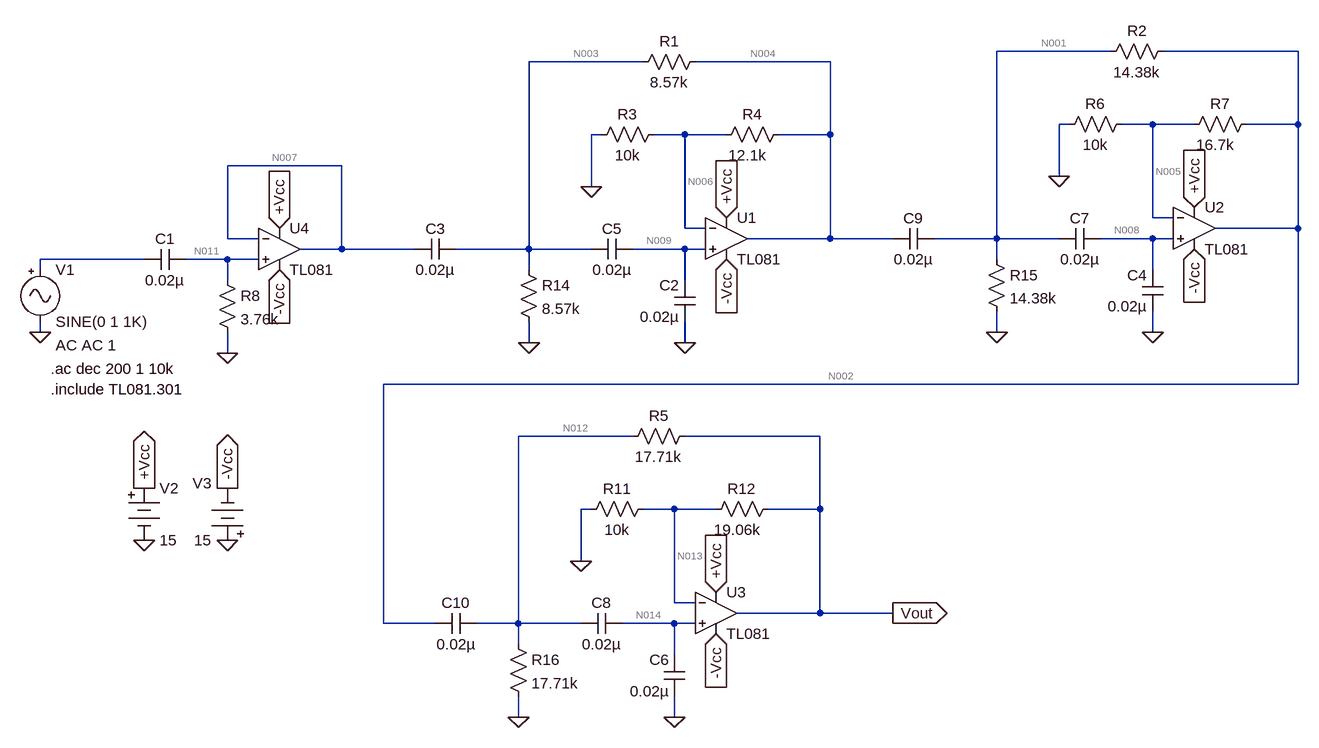
[diagram p0: schematic 7th order Chebyshev filter.asc]
7th order Chebyshev filter.asc, the LTspice schematic file:
Version 4
SHEET 1 2320 916
WIRE 1088 -144 912 -144
WIRE 1376 -144 1168 -144
WIRE 368 -128 192 -128
WIRE 656 -128 448 -128
WIRE 1024 -32 1008 -32
WIRE 1152 -32 1104 -32
WIRE 1216 -32 1152 -32
WIRE 1376 -32 1376 -144
WIRE 1376 -32 1296 -32
WIRE 304 -16 288 -16
WIRE 432 -16 384 -16
WIRE 496 -16 432 -16
WIRE 656 -16 656 -128
WIRE 656 -16 576 -16
WIRE -96 32 -272 32
WIRE 1008 48 1008 -32
WIRE 288 64 288 -16
WIRE 1152 112 1152 -32
WIRE 1184 112 1152 112
WIRE 432 128 432 -16
WIRE 464 128 432 128
WIRE 1376 128 1376 -32
WIRE 1376 128 1248 128
WIRE -272 144 -272 32
WIRE -224 144 -272 144
WIRE 656 144 656 -16
WIRE 656 144 528 144
WIRE 752 144 656 144
WIRE 912 144 912 -144
WIRE 912 144 816 144
WIRE 1008 144 912 144
WIRE 1152 144 1072 144
WIRE 1184 144 1152 144
WIRE -96 160 -96 32
WIRE -96 160 -160 160
WIRE 16 160 -96 160
WIRE 192 160 192 -128
WIRE 192 160 80 160
WIRE 288 160 192 160
WIRE 432 160 352 160
WIRE 464 160 432 160
WIRE -400 176 -560 176
WIRE -272 176 -336 176
WIRE -224 176 -272 176
WIRE 912 176 912 144
WIRE -560 192 -560 176
WIRE 192 192 192 160
WIRE 1152 192 1152 144
WIRE -272 208 -272 176
WIRE 432 208 432 160
WIRE -560 288 -560 272
WIRE 912 288 912 256
WIRE 1152 288 1152 256
WIRE 192 304 192 272
WIRE 432 304 432 272
WIRE -272 320 -272 288
WIRE 1376 368 1376 128
WIRE 1376 368 -32 368
WIRE 352 448 176 448
WIRE 640 448 432 448
WIRE 288 560 272 560
WIRE 416 560 368 560
WIRE 480 560 416 560
WIRE 640 560 640 448
WIRE 640 560 560 560
WIRE 272 640 272 560
WIRE 416 704 416 560
WIRE 448 704 416 704
WIRE 640 720 640 560
WIRE 640 720 512 720
WIRE 752 720 640 720
WIRE -32 736 -32 368
WIRE 48 736 -32 736
WIRE 176 736 176 448
WIRE 176 736 112 736
WIRE 272 736 176 736
WIRE 416 736 336 736
WIRE 448 736 416 736
WIRE 176 768 176 736
WIRE 416 784 416 736
WIRE 176 880 176 848
WIRE 416 880 416 848
FLAG 432 304 0
FLAG 288 64 0
FLAG -560 288 0
FLAG -400 608 0
FLAG -272 608 0
FLAG -400 528 +Vcc
IOPIN -400 528 Out
FLAG -272 528 -Vcc
IOPIN -272 528 Out
FLAG 496 112 +Vcc
IOPIN 496 112 In
FLAG 496 176 -Vcc
IOPIN 496 176 In
FLAG 1152 288 0
FLAG 1008 48 0
FLAG 1216 96 +Vcc
IOPIN 1216 96 In
FLAG 1216 160 -Vcc
IOPIN 1216 160 In
FLAG 416 880 0
FLAG 272 640 0
FLAG 480 688 +Vcc
IOPIN 480 688 In
FLAG 480 752 -Vcc
IOPIN 480 752 In
FLAG -192 128 +Vcc
IOPIN -192 128 In
FLAG -192 192 -Vcc
IOPIN -192 192 In
FLAG -272 320 0
FLAG 192 304 0
FLAG 912 288 0
FLAG 176 880 0
FLAG 752 720 Vout
IOPIN 752 720 Out
SYMBOL res 400 -32 R90
WINDOW 0 0 56 VBottom 2
WINDOW 3 32 56 VTop 2
SYMATTR InstName R3
SYMATTR Value 10k
SYMBOL res 592 -32 R90
WINDOW 0 0 56 VBottom 2
WINDOW 3 32 63 VTop 2
SYMATTR InstName R4
SYMATTR Value 12.1k
SYMBOL cap 448 272 R180
WINDOW 0 24 56 Left 2
WINDOW 3 24 8 Left 2
SYMATTR InstName C2
SYMATTR Value 0.02µ
SYMBOL Misc\\signal -560 176 R0
WINDOW 123 24 132 Left 2
WINDOW 39 0 0 Left 0
SYMATTR Value2 AC AC 1
SYMATTR InstName V1
SYMBOL Misc\\battery -400 512 R0
WINDOW 123 0 0 Left 0
WINDOW 39 0 0 Left 0
SYMATTR InstName V2
SYMATTR Value 15
SYMBOL Misc\\battery -272 624 R180
WINDOW 0 24 104 Left 2
WINDOW 3 24 16 Left 2
WINDOW 123 0 0 Left 0
WINDOW 39 0 0 Left 0
SYMATTR InstName V3
SYMATTR Value 15
SYMBOL res 1120 -48 R90
WINDOW 0 0 56 VBottom 2
WINDOW 3 32 56 VTop 2
SYMATTR InstName R6
SYMATTR Value 10k
SYMBOL res 1312 -48 R90
WINDOW 0 0 56 VBottom 2
WINDOW 3 32 63 VTop 2
SYMATTR InstName R7
SYMATTR Value 16.7k
SYMBOL cap 1168 256 R180
WINDOW 0 24 56 Left 2
WINDOW 3 24 8 Left 2
SYMATTR InstName C4
SYMATTR Value 0.02µ
SYMBOL res 384 544 R90
WINDOW 0 0 56 VBottom 2
WINDOW 3 32 56 VTop 2
SYMATTR InstName R11
SYMATTR Value 10k
SYMBOL res 576 544 R90
WINDOW 0 0 56 VBottom 2
WINDOW 3 32 63 VTop 2
SYMATTR InstName R12
SYMATTR Value 19.06k
SYMBOL cap 432 848 R180
WINDOW 0 24 56 Left 2
WINDOW 3 24 8 Left 2
SYMATTR InstName C6
SYMATTR Value 0.02µ
SYMBOL OpAmps\\opamp2 496 80 R0
SYMATTR InstName U1
SYMATTR Value TL081
SYMBOL OpAmps\\opamp2 1216 64 R0
SYMATTR InstName U2
SYMATTR Value TL081
SYMBOL OpAmps\\opamp2 480 656 R0
SYMATTR InstName U3
SYMATTR Value TL081
SYMBOL OpAmps\\opamp2 -192 96 R0
SYMATTR InstName U4
SYMATTR Value TL081
SYMBOL res 176 176 R0
SYMATTR InstName R14
SYMATTR Value 8.57k
SYMBOL res 896 160 R0
SYMATTR InstName R15
SYMATTR Value 14.38k
SYMBOL res 160 752 R0
SYMATTR InstName R16
SYMATTR Value 17.71k
SYMBOL res 464 -144 R90
WINDOW 0 0 56 VBottom 2
WINDOW 3 32 56 VTop 2
SYMATTR InstName R1
SYMATTR Value 8.57k
SYMBOL res 1184 -160 R90
WINDOW 0 0 56 VBottom 2
WINDOW 3 32 56 VTop 2
SYMATTR InstName R2
SYMATTR Value 14.38k
SYMBOL res 448 432 R90
WINDOW 0 0 56 VBottom 2
WINDOW 3 32 56 VTop 2
SYMATTR InstName R5
SYMATTR Value 17.71k
SYMBOL cap -336 160 R90
WINDOW 0 0 32 VBottom 2
WINDOW 3 32 32 VTop 2
SYMATTR InstName C1
SYMATTR Value 0.02µ
SYMBOL cap 80 144 R90
WINDOW 0 0 32 VBottom 2
WINDOW 3 32 32 VTop 2
SYMATTR InstName C3
SYMATTR Value 0.02µ
SYMBOL cap 352 144 R90
WINDOW 0 0 32 VBottom 2
WINDOW 3 32 32 VTop 2
SYMATTR InstName C5
SYMATTR Value 0.02µ
SYMBOL cap 336 720 R90
WINDOW 0 0 32 VBottom 2
WINDOW 3 32 32 VTop 2
SYMATTR InstName C8
SYMATTR Value 0.02µ
SYMBOL cap 1072 128 R90
WINDOW 0 0 32 VBottom 2
WINDOW 3 32 32 VTop 2
SYMATTR InstName C7
SYMATTR Value 0.02µ
SYMBOL cap 112 720 R90
WINDOW 0 0 32 VBottom 2
WINDOW 3 32 32 VTop 2
SYMATTR InstName C10
SYMATTR Value 0.02µ
SYMBOL res -288 192 R0
SYMATTR InstName R8
SYMATTR Value 3.76k
SYMBOL cap 816 128 R90
WINDOW 0 0 32 VBottom 2
WINDOW 3 32 32 VTop 2
SYMATTR InstName C9
SYMATTR Value 0.02µ
TEXT -544 344 Left 2 !.ac dec 200 1 10k
TEXT -544 376 Left 2 !.include TL081.301

The netlist it stands for:
* 7th order Chebyshev filter.asc
R3 N006 0 10k
R4 N004 N006 12.1k
C2 0 N009 0.02µ
V1 N010 0 SINE(0 1 1K) AC AC 1
V2 +Vcc 0 15
V3 0 -Vcc 15
R6 N005 0 10k
R7 N002 N005 16.7k
C4 0 N008 0.02µ
R11 N013 0 10k
R12 Vout N013 19.06k
C6 0 N014 0.02µ
XU1 N009 N006 +Vcc -Vcc N004 TL081  ; pins In+ In- V+ V- OUT
XU2 N008 N005 +Vcc -Vcc N002 TL081  ; pins In+ In- V+ V- OUT
XU3 N014 N013 +Vcc -Vcc Vout TL081  ; pins In+ In- V+ V- OUT
XU4 N011 N007 +Vcc -Vcc N007 TL081  ; pins In+ In- V+ V- OUT
R14 N003 0 8.57k
R15 N001 0 14.38k
R16 N012 0 17.71k
R1 N004 N003 8.57k
R2 N002 N001 14.38k
R5 Vout N012 17.71k
C1 N011 N010 0.02µ
C3 N003 N007 0.02µ
C5 N009 N003 0.02µ
C8 N014 N012 0.02µ
C7 N008 N001 0.02µ
C10 N012 N002 0.02µ
R8 N011 0 3.76k
C9 N001 N004 0.02µ
.ac dec 200 1 10k
.include TL081.301
.backanno
.end

* Results of the author's LTspice run, read from the files saved beside the schematic
* Operating Point, zero values left out:
*   V(n006) = -6.099 V
*   V(n004) = -13.48 V
*   V(n009) = -13.75 V
*   V(+vcc) = 15 V
*   V(-vcc) = -15 V
*   V(n005) = -5.048 V
*   V(n002) = -13.48 V
*   V(n008) = -13.75 V
*   V(n013) = -4.638 V
*   V(vout) = -13.48 V
*   V(n014) = -13.75 V
*   V(n007) = 10.8 µV
*   V(n011) = -169.4 nV
*   V(n003) = -6.739 V
*   V(n001) = -6.739 V
*   V(n012) = -6.739 V
*   I(R3) = -609.9 µA
*   I(R4) = -609.9 µA
*   I(R6) = -504.8 µA
*   I(R7) = -504.8 µA
*   I(R11) = -463.8 µA
*   I(R12) = -463.8 µA
*   I(R14) = -786.4 µA
*   I(R15) = -468.6 µA
*   I(R16) = -380.5 µA
*   I(R1) = -786.4 µA
*   I(R2) = -468.6 µA
*   I(R5) = -380.5 µA
*   I(R8) = -45.05 pA
*   I(V2) = -56.78 mA
*   I(V3) = -56.23 mA
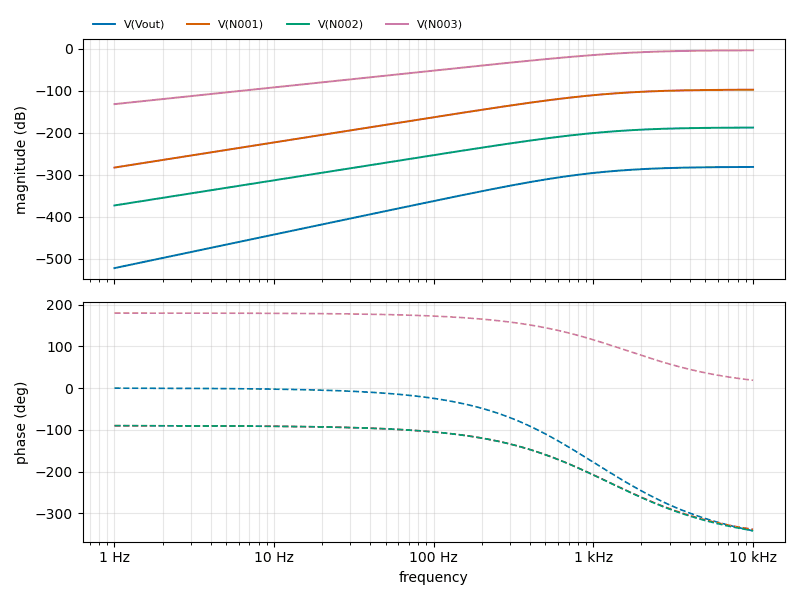
[diagram p1: AC Analysis of 7th order Chebyshev filter.asc, plotted from the saved traces]
* AC Analysis, 1 run:
*   V(Vout): -522.44 dB at 1 Hz, -281.54 dB at 10 kHz, peak -281.54 dB at 10 kHz, 3 dB below the peak at 2.721 kHz
*   V(N001): -282.97 dB at 1 Hz, -97.54 dB at 10 kHz, peak -97.54 dB at 10 kHz, 3 dB below the peak at 2.658 kHz
*   V(N002): -373.17 dB at 1 Hz, -187.77 dB at 10 kHz, peak -187.77 dB at 10 kHz, 3 dB below the peak at 2.644 kHz
*   V(N003): -131.89 dB at 1 Hz, -3.78 dB at 10 kHz, peak -3.78 dB at 10 kHz, 3 dB below the peak at 2.516 kHz